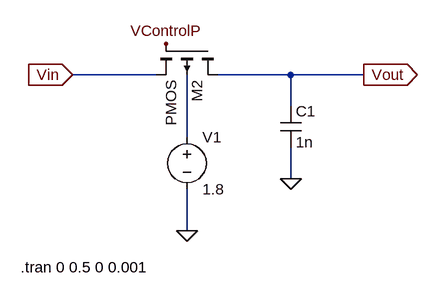
[diagram p0: schematic Lab 6 Part 2b.asc]
Lab 6 Part 2b.asc, the LTspice schematic file:
Version 4
SHEET 1 880 680
WIRE 32 208 -96 208
WIRE 240 208 128 208
WIRE 352 208 240 208
WIRE 240 256 240 208
WIRE 80 304 80 208
WIRE 240 368 240 320
WIRE 80 448 80 384
FLAG -96 208 Vin
IOPIN -96 208 In
FLAG 352 208 Vout
IOPIN 352 208 Out
FLAG 240 368 0
FLAG 48 160 VControlP
FLAG 80 448 0
SYMBOL cap 224 256 R0
SYMATTR InstName C1
SYMATTR Value 1n
SYMBOL voltage 80 288 R0
SYMATTR InstName V1
SYMATTR Value 1.8
SYMBOL pmos4 128 160 R90
SYMATTR InstName M2
TEXT -176 504 Left 2 !.tran 0 0.5 0 0.001

The netlist it stands for:
* Lab 6 Part 2b.asc
C1 Vout 0 1n
V1 N001 0 1.8
M2 Vout VControlP Vin N001 PMOS
.model NMOS NMOS
.model PMOS PMOS
.lib standard.mos
.tran 0 0.5 0 0.001
.backanno
.end